# EAGLE board ARM_board (EAGLE 6.1), part 1 of 2
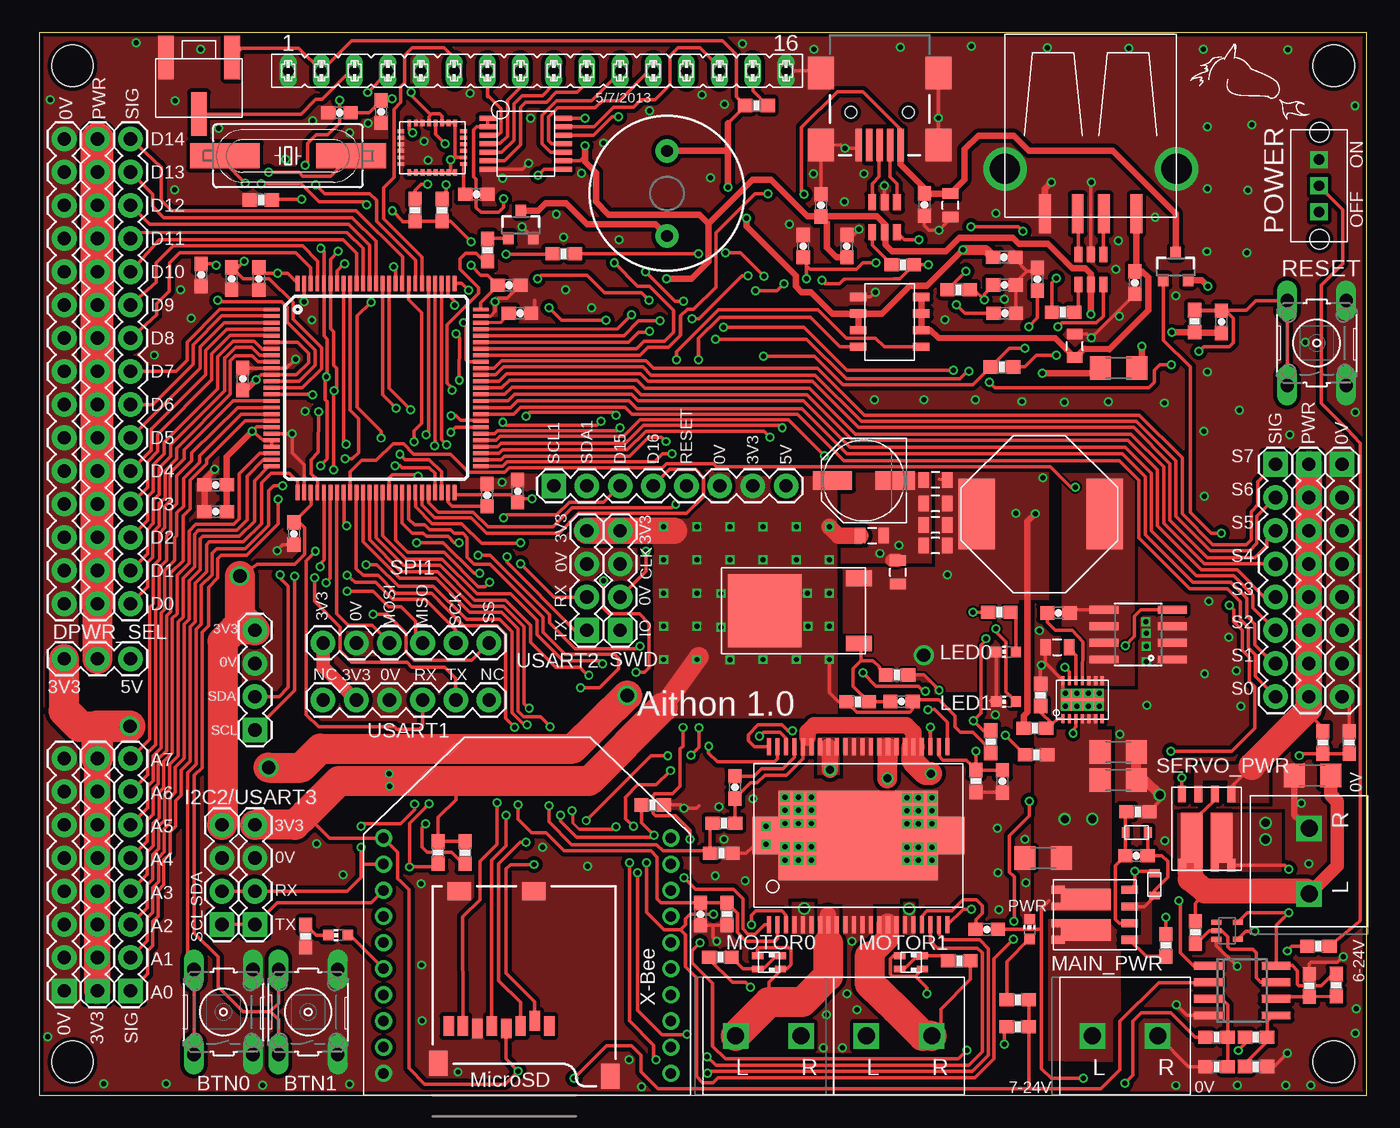
[diagram p2: board, top side]
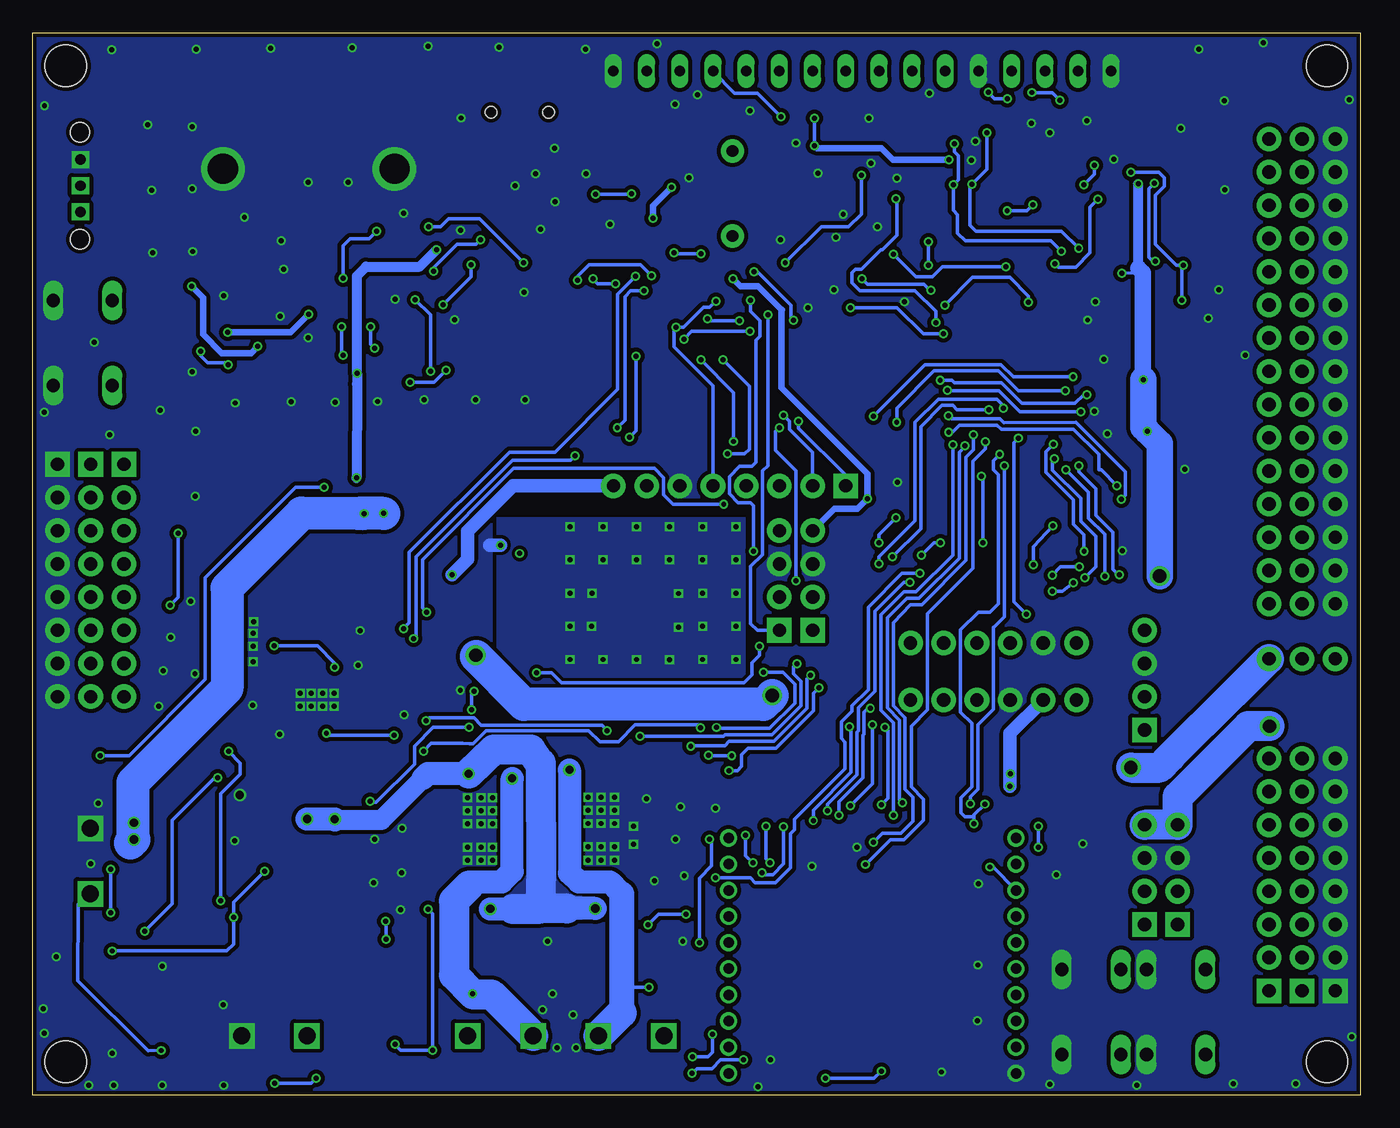
[diagram p3: board, bottom side, seen from below]

Size 101.6 x 81.28 mm. Coordinates in mm from the lower left corner, seen from the top.
Outline: 0,0 101.6,0 101.6,81.28 0,81.28 0,0
Copper layers (1*16): Top 0.035mm / dielectric 1.5mm / Bottom 0.035mm
Design rules: minimum track width 6mil, minimum drill 12mil, track to track 6mil, track to pad 6mil, pad to pad 6mil, via to via 6mil, smd to smd 0mil, copper to edge 10mil, drill to drill 10mil, minimum pad ring 10mil, minimum via ring 6mil, stop-mask expansion 2mil, vias tented up to drill 100mil, thermal gap 10mil
Holes 3.17 mm at 2.54,78.74 99.06,78.74 99.06,2.54 2.54,2.54

## Footprints (pad centres in the part's own frame; a part is rotated, then mirrored left to right if it is on the bottom)
DPAK = smd 1.2 x 2: 1 -2.5,-2.5; 3 2.5,-2.5 | smd 5.6 x 5.6: TAB 0,4.7
B3F-10XX = drill 1.016 long: 1 -3.251,2.261; 2 3.251,2.261; 3 -3.251,-2.261; 4 3.251,-2.261
0805 = smd 0.8 x 1.2: 1 -0.9,0; 2 0.9,0
0603-CAP = smd 1.1 x 1: 1 -0.85,0; 2 0.85,0
1206 = smd 1.6 x 1.8: 1 -1.4,0; 2 1.4,0
PANASONIC_D = smd 3 x 1.4: + 2.4,0; - -2.4,0
1206' = smd 1.6 x 1.8: 1 -0.13,2.54; 2 2.67,2.54
TQFP100 = smd 1.2 x 0.3: 1 -8,6; 2 -8,5.5; 3 -8,5; 4 -8,4.5; 5 -8,4; 6 -8,3.5; 7 -8,3; 8 -8,2.5; 9 -8,2; 10 -8,1.5; 11 -8,1; 12 -8,0.5; 13 -8,0; 14 -8,-0.5; 15 -8,-1; 16 -8,-1.5; 17 -8,-2; 18 -8,-2.5; 19 -8,-3; 20 -8,-3.5; 21 -8,-4; 22 -8,-4.5; 23 -8,-5; 24 -8,-5.5; 25 -8,-6; 51 8,-6; 52 8,-5.5; 53 8,-5; 54 8,-4.5; 55 8,-4; 56 8,-3.5; 57 8,-3; 58 8,-2.5; 59 8,-2; 60 8,-1.5; 61 8,-1; 62 8,-0.5; 63 8,0; 64 8,0.5; 65 8,1; 66 8,1.5; 67 8,2; 68 8,2.5; 69 8,3; 70 8,3.5; 71 8,4; 72 8,4.5; 73 8,5; 74 8,5.5; 75 8,6 | smd 0.3 x 1.2: 26 -6,-8; 27 -5.5,-8; 28 -5,-8; 29 -4.5,-8; 30 -4,-8; 31 -3.5,-8; 32 -3,-8; 33 -2.5,-8; 34 -2,-8; 35 -1.5,-8; 36 -1,-8; 37 -0.5,-8; 38 0,-8; 39 0.5,-8; 40 1,-8; 41 1.5,-8; 42 2,-8; 43 2.5,-8; 44 3,-8; 45 3.5,-8; 46 4,-8; 47 4.5,-8; 48 5,-8; 49 5.5,-8; 50 6,-8; 76 6,8; 77 5.5,8; 78 5,8; 79 4.5,8; 80 4,8; 81 3.5,8; 82 3,8; 83 2.5,8; 84 2,8; 85 1.5,8; 86 1,8; 87 0.5,8; 88 0,8; 89 -0.5,8; 90 -1,8; 91 -1.5,8; 92 -2,8; 93 -2.5,8; 94 -3,8; 95 -3.5,8; 96 -4,8; 97 -4.5,8; 98 -5,8; 99 -5.5,8; 100 -6,8
SO08 = smd 0.6 x 2.2: 1 -1.905,-2.6; 2 -0.635,-2.6; 3 0.635,-2.6; 4 1.905,-2.6; 5 1.905,2.6; 6 0.635,2.6; 7 -0.635,2.6; 8 -1.905,2.6
1X04 = drill 1.016 pad 1.88 square: 1 0,0 | drill 1.016 pad 1.88: 2 2.54,0; 3 5.08,0; 4 7.62,0
1X06 = drill 1.016 pad 1.88: 1 0,0; 2 2.54,0; 3 5.08,0; 4 7.62,0; 5 10.16,0; 6 12.7,0
1X08 = drill 1.016 pad 1.88 square: 1 0,0 | drill 1.016 pad 1.88: 2 2.54,0; 3 5.08,0; 4 7.62,0; 5 10.16,0; 6 12.7,0; 7 15.24,0; 8 17.78,0
1X15 = drill 1.016 pad 1.88: 1 0,0; 2 2.54,0; 3 5.08,0; 4 7.62,0; 5 10.16,0; 6 12.7,0; 7 15.24,0; 8 17.78,0; 9 20.32,0; 10 22.86,0; 11 25.4,0; 12 27.94,0; 13 30.48,0; 14 33.02,0; 15 35.56,0
1X03 = drill 1.016 pad 1.88: 1 0,0; 2 2.54,0; 3 5.08,0
INDUCTOR = smd 2.8 x 5.4: P$1 0,0; P$2 9.8,0
LCD = drill 0.8 long: A 16.51,0; DB0 -3.81,0; DB1 -1.27,0; DB2 1.27,0; DB3 3.81,0; DB4 6.35,0; DB5 8.89,0; DB6 11.43,0; DB7 13.97,0; E -6.35,0; K 19.05,0; R/W -8.89,0; RS -11.43,0; VDD -16.51,0; VO -13.97,0; VSS -19.05,0
CHIP-LED0603 = smd 0.8 x 0.8: A 0,-0.75; C 0,0.75
LED-0606 = smd 0.85 x 0.5: 1 0.875,0.5; 2 -0.875,0.5; 3 0.875,-0.5; 4 -0.875,-0.5
2POS_TERMINAL = drill 1.3 square: L -5,0; R 0,0
POT = smd 1.194 x 3.302: 1 -2.54,0; 2 0,4.318; 3 2.54,0
SOT23-3 = smd 0.8 x 0.9: 1 -0.95,-1; 2 0.95,-1; 3 0,1.1
SO08' = smd 0.61 x 2.21: 1 -1.905,-2.616; 2 -0.635,-2.616; 3 0.635,-2.616; 4 1.905,-2.616; 5 1.905,2.616; 6 0.635,2.616; 7 -0.635,2.616; 8 -1.905,2.616
POWERPAK = smd 1.27 x 0.61: 1 0,2.54; 2 0,1.27; 3 0,0; 4 0,-1.27 | smd 1.016 x 0.61: 5 5.461,-1.27; 6 5.461,0; 7 5.461,1.27; 8 5.461,2.54 | smd 3.81 x 1.651: 9 3.353,1.791; 10 3.353,-0.521
0603-RES = smd 1.1 x 1: 1 -0.85,0; 2 0.85,0
MICRO-SD-SOCKET-PP = smd 0.8 x 1.5: 1 -8.94,10.7; 2 -7.84,10.3; 3 -6.74,10.7; 4 -5.64,10.9; 5 -4.54,10.7; 6 -3.44,10.9; 7 -2.34,10.7; 8 -1.24,10.7 | smd 1.8 x 1.4: CD1 -2.05,0.4; CD2 -7.75,0.4 | smd 1.4 x 1.9: GND1 -13.6,14.55; GND3 -0.45,13.55
BUZZER-12MM = drill 0.9 pad 1.778: + 3.25,0; - -3.25,0
SW = drill 0.8 square: P$1 0,0; P$2 2,0; P$3 -2,0 | hole 1.5: -4.1,-0.04; 4.1,-0.04
HSOP44 = smd 1.3 x 0.3: P$1 -6.85,6.85; P$2 -6.85,6.2; P$3 -6.85,5.55; P$4 -6.85,4.9; P$5 -6.85,4.25; P$6 -6.85,3.6; P$7 -6.85,2.95; P$8 -6.85,2.3; P$9 -6.85,1.65; P$10 -6.85,1; P$11 -6.85,0.35; P$12 -6.85,-0.3; P$13 -6.85,-0.95; P$14 -6.85,-1.6; P$15 -6.85,-2.25; P$16 -6.85,-2.9; P$17 -6.85,-3.55; P$18 -6.85,-4.2; P$19 -6.85,-4.85; P$20 -6.85,-5.5; P$21 -6.85,-6.15; P$22 -6.85,-6.8; P$23 6.8,-6.8; P$24 6.8,-6.15; P$25 6.8,-5.5; P$26 6.8,-4.85; P$27 6.8,-4.2; P$28 6.8,-3.55; P$29 6.8,-2.9; P$30 6.8,-2.25; P$31 6.8,-1.6; P$32 6.8,-0.95; P$33 6.8,-0.3; P$34 6.8,0.35; P$35 6.8,1; P$36 6.8,1.65; P$37 6.8,2.3; P$38 6.8,2.95; P$39 6.8,3.6; P$40 6.8,4.25; P$41 6.8,4.9; P$42 6.8,5.55; P$43 6.8,6.2; P$44 6.8,6.85 | smd 6.85 x 12.2: P$45 0,0 | smd 2.9 x 2: P$46 0,7.1; P$47 0,-7.1
WDFN-14L = smd 0.25 x 0.7: 1 -1.5,-1.45; 2 -1,-1.45; 3 -0.5,-1.45; 4 0,-1.45; 5 0.5,-1.45; 6 1,-1.45; 7 1.5,-1.45; 8 1.5,1.45; 9 1,1.45; 10 0.5,1.45; 11 0,1.45; 12 -0.5,1.45; 13 -1,1.45; 14 -1.5,1.45 | smd 3.3 x 1.7: P$1 0,0
SC70 = smd 0.4 x 0.75: 1 -0.65,-0.825; 2 0,-0.825; 3 0.65,-0.825; 4 0.65,0.825; 5 -0.65,0.825
SOT23-6L = smd 1.2 x 0.6: P$1 -1.1,0.9; P$2 -1.1,-0.05; P$3 -1.1,-1; P$4 1.2,-1; P$5 1.2,-0.05; P$6 1.2,0.9
LGA-28 = smd 0.5 x 0.3: 1 -2.4,1.25; 2 -2.4,0.75; 3 -2.4,0.25; 4 -2.4,-0.25; 5 -2.4,-0.75; 6 -2.4,-1.25; 15 2.4,-1.25; 16 2.4,-0.75; 17 2.4,-0.25; 18 2.4,0.25; 19 2.4,0.75; 20 2.4,1.25 | smd 0.3 x 0.5: 7 -1.75,-1.9; 8 -1.25,-1.9; 9 -0.75,-1.9; 10 -0.25,-1.9; 11 0.25,-1.9; 12 0.75,-1.9; 13 1.25,-1.9; 14 1.75,-1.9; 21 1.75,1.9; 22 1.25,1.9; 23 0.75,1.9; 24 0.25,1.9; 25 -0.25,1.9; 26 -0.75,1.9; 27 -1.25,1.9; 28 -1.75,1.9
8-SOIC = smd 0.635 x 1.27: 1 -1.27,-1.778; 2 0,-1.778; 3 1.27,-1.778; 4 2.54,-1.778; 5 2.54,3.048; 6 1.27,3.048; 7 0,3.048; 8 -1.27,3.048
TSSOP-14 = smd 1.26 x 0.36: 1 -2.9,1.95; 2 -2.9,1.3; 3 -2.9,0.65; 4 -2.9,0; 5 -2.9,-0.65; 6 -2.9,-1.3; 7 -2.9,-1.95; 8 2.9,-1.95; 9 2.9,-1.3; 10 2.9,-0.65; 11 2.9,0; 12 2.9,0.65; 13 2.9,1.3; 14 2.9,1.95
USB-A-S = smd 3 x 0.9: D+ 3.45,-1; D- 3.45,1; GND 3.45,-3.5; VBUS 3.45,3.5 | drill 2.311: GND@1 0,6.566; GND@2 0,-6.566
USB-MINIB = smd 2.5 x 0.5: D+ 2.5,0; D- 2.5,0.8; GND 2.5,-1.6; ID 2.5,-0.8; VBUS 2.5,1.6 | smd 2.5 x 2: MTN1 -3,4.5; MTN2 2.5,4.5; MTN3 -3,-4.5; MTN4 2.5,-4.5 | hole 0.9: 0,2.2; 0,-2.2
XBEE = drill 0.8 pad 1.27: 1 -11,9; 2 -11,7; 3 -11,5; 4 -11,3; 5 -11,1; 6 -11,-1; 7 -11,-3; 8 -11,-5; 9 -11,-7; 10 -11,-9; 11 11,-9; 12 11,-7; 13 11,-5; 14 11,-3; 15 11,-1; 16 11,1; 17 11,3; 18 11,5; 19 11,7; 20 11,9
HC49UP = smd 5.334 x 1.93: 1 -4.826,0; 2 4.826,0
0603 = smd 0.6 x 0.8: P$1 1.7,0; P$2 0,0

## Placement (x,y rotation side)
AP1084  AP1084  [DPAK]  60.22,37.05 90 top
BTN0  [B3F-10XX]  14.1,6.35 90 top
BTN1  [B3F-10XX]  20.57,6.35 90 top
C1  10u  [0805]  65.71,40.01 90 top
C2  20p  [0603-CAP]  14.72,62.47 270 top
C3  22u  [0805]  68.58,47.07 180 top
C4  22u  [0805]  68.58,45.26 180 top
C5  22u  [0805]  68.58,43.61 180 top
C6  10u  [0805]  63.74,42.8 0 top
C7  2.2u  [0603-CAP]  34.26,45.9 90 top
C8  0.1u  [0603-CAP]  72.52,12.67 180 top
C9  0.1u  [0603-CAP]  53.24,23.55 270 top
C10  1u  [0603-CAP]  50.6,13.85 270 top
C11  1u  [0603-CAP]  73.71,24 270 top
C12  0.1u  [0603-CAP]  59.82,68.07 90 top
C13  47p  [0603-CAP]  73.89,59.82 0 top
C14  47p  [0603-CAP]  73.86,61.98 0 top
C15  0.1u  [0603-CAP]  73.84,64.11 0 top
C16  0.1u  [0603-CAP]  61.8,64.95 90 top
C17  47p  [0603-CAP]  58.46,64.95 90 top
C18  47p  [0603-CAP]  76.39,62.41 90 top
C19  20p  [0603-CAP]  12.38,62.75 270 top
C21  0.1u  [0603-CAP]  83.86,62.16 270 top
C22  0.1u  [0603-CAP]  67.74,68.12 90 top
C23  10u  [0805]  79.24,57.32 90 top
C24  10u  [0805]  69.72,68.07 90 top
C25  10u  [0603-CAP]  26.16,75.24 270 top
C26  10u  [1206]  82.58,26.24 0 top
C27  22u  [1206]  97.43,24.43 180 top
C28  10u  [1206]  82.58,24.1 0 top
C29  0.1u  [0603-CAP]  83.97,18.31 180 top
C30  10n  [0603-CAP]  90.47,59.16 90 top
C31  22u  [1206]  76.83,18.14 180 top
C32  1u  [0603-CAP]  78,36.88 0 top
C33  10u  [0805]  77.9,34.26 0 top
C34  0.1u  [0603-CAP]  22.97,75.16 180 top
C35  10n  [0603-CAP]  33.45,68.92 0 top
C36  22u  [0805]  68.58,42.04 180 top
C37  2.2u  [0603-CAP]  36.78,59.82 0 top
C38  0.1u  [0603-CAP]  65.99,30.11 180 top
C39  4.7u  [0603-CAP]  15.58,54.79 90 top
C40  100n  [0603-CAP]  16.8,62.47 270 top
C41  100n  [0603-CAP]  35.96,61.96 0 top
C42  100n  [0603-CAP]  19.49,42.96 270 top
C43  100n  [0603-CAP]  36.62,46.21 90 top
C44  220u  [PANASONIC_D]  63.1,47.02 180 top
C46  1u  [0603-CAP]  13.5,44.64 180 top
C47  10n  [0603-CAP]  13.5,46.68 180 top
F1  POLYFUSE  [1206']  83.88,58.16 180 top
IC3  STM32F407VET  [TQFP100]  25.78,54.1 0 top
IC4  LM358D  [SO08]  92.06,8 270 top
J1  USART/I2C  [1X04]  13.97,13.06 90 top
J2  I2C2/USART3  [1X04]  16.51,13.06 90 top
J3  USART2  [1X04]  41.91,35.56 90 top
J4  I2C1  [1X04]  16.51,27.94 90 top
J5  SPI  [1X06]  21.72,34.59 0 top
J6  Bluesmirf  [1X06]  34.42,30.23 180 top
J7  SWD  [1X04]  44.45,35.56 90 top
J8  AGND  [1X08]  1.91,7.98 90 top
J9  APWR  [1X08]  4.45,7.98 90 top
J10  ANALOG  [1X08]  6.99,7.98 90 top
J11  DGND  [1X15]  1.91,37.59 90 top
J12  DPWR  [1X15]  4.45,37.59 90 top
J13  DIGITAL  [1X15]  6.99,37.59 90 top
J14  SGND  [1X08]  99.69,48.26 270 top
J15  SPWR  [1X08]  97.16,48.26 270 top
J16  SERVO  [1X08]  94.61,48.26 270 top
JP1  SHIELD  [1X08]  39.37,46.61 0 top
JP2  DPWR_SEL  [1X03]  1.91,33.38 0 top
L1  2.7u  [INDUCTOR]  81.53,44.45 180 top
LCD  LCD_DISPLAY  [LCD]  38.1,78.36 0 top
LED2  YELLOW  [CHIP-LED0603]  73.99,33.91 90 top
LED3  YELLOW  [CHIP-LED0603]  73.99,30.1 90 top
LED4  RED  [CHIP-LED0603]  75.78,12.7 0 top
LED5  YELLOW  [CHIP-LED0603]  22.87,12.24 90 top
LED6  LED_R/G  [LED-0606]  55.85,10.16 180 top
LED7  LED_R/G  [LED-0606]  66.73,10.16 180 top
MOTOR0  2POS_TERMINAL  [2POS_TERMINAL]  58.29,4.52 0 top
MOTOR1  2POS_TERMINAL  [2POS_TERMINAL]  68.3,4.52 0 top
POT  10K  [POT]  12.22,79.38 180 top
POWER  2POS_TERMINAL  [2POS_TERMINAL]  85.6,4.52 0 top
Q1  Si2301  [SOT23-3]  86.97,63.35 0 top
Q2  BC817  [SOT23-3]  36.86,66.55 0 top
Q3  FDS6670AS  [SO08']  84.1,35.23 90 top
Q4  SI7997DP  [POWERPAK]  88.7,23.04 270 top
Q5  SI7997DP  [POWERPAK]  83.44,14.43 180 top
R1  10  [0603-RES]  54.88,75.71 180 top
R2  100k  [0603-RES]  84.07,21.69 0 top
R3  100k  [0603-RES]  86.21,11.46 270 top
R4  220  [0603-RES]  74.89,7.29 0 top
R5  10k  [0603-RES]  72.81,27.03 270 top
R6  10k  [0603-RES]  74.88,5.22 180 top
R7  10k  [0603-RES]  88.42,59.21 270 top
R8  220  [0603-RES]  52.63,13.85 90 top
R9  220  [0603-RES]  71.68,24.03 90 top
R10  10k  [0603-RES]  90.1,4.41 180 top
R11  10k  [0603-RES]  90.1,2.18 0 top
R18  93.1k  [0603-RES]  52.4,20.8 180 top
R19  10k  [0603-RES]  52.2,18.52 0 top
R20  220  [0603-RES]  73.47,36.95 180 top
R21  220  [0603-RES]  40.13,64.36 180 top
R22  4.7k  [0603-RES]  28.77,67.71 270 top
R23  4.7k  [0603-RES]  30.82,67.71 270 top
R24  4.7k  [0603-RES]  32.58,18.55 90 top
R25  4.7k  [0603-RES]  30.53,18.56 90 top
R26  10k  [0603-RES]  97.21,8.38 270 top
R27  39k  [0603-RES]  99.26,8.41 90 top
R28  10k  [0603-RES]  93.12,2.18 0 top
R29  39k  [0603-RES]  93.12,4.42 0 top
R31  10k  [0603-RES]  97.89,11.38 0 top
R32  93.1k  [0603-RES]  76.19,28.07 180 top
R33  18k  [0603-RES]  76.63,30.61 270 top
R34  100k  [0603-RES]  76.29,26.04 0 top
R35  220  [0603-RES]  20.4,12.17 90 top
R36  10k  [0603-RES]  88.47,12.45 90 top
R37  2k  [0603-RES]  52.12,10.54 0 top
R38  2k  [0603-RES]  70.41,10.26 180 top
R39  10k  [0603-RES]  34.32,64.64 90 top
R40  93.1k  [0603-RES]  98.22,26.97 270 top
R41  10k  [0603-RES]  100.24,26.97 90 top
R42  10k  [0603-RES]  16.96,68.48 0 top
R43  10k  [0603-RES]  46.94,22.19 180 top
R44  2k  [0603-RES]  65.64,32.14 180 top
R45  1.21k  [0603-RES]  62.64,30.09 180 top
R46  15  [0603-RES]  70.35,61.62 0 top
R47  15  [0603-RES]  66.09,63.51 0 top
R48  15  [0603-RES]  78.35,59.88 180 top
R49  15  [0603-RES]  73.67,55.7 180 top
RESET  [B3F-10XX]  97.76,57.53 90 top
SD  USD-SOCKETNEW  [MICRO-SD-SOCKET-PP]  30.09,15.99 180 top
SERVO_PWR  2POS_TERMINAL  [2POS_TERMINAL]  97.18,20.4 90 top
SG1  BUZZERPTH  [BUZZER-12MM]  48.05,68.98 90 top
SW1  SW  [SW]  97.94,69.57 90 top
U1  MC33932  [HSOP44]  62.69,19.86 90 top
U2  RT7259  [WDFN-14L]  79.83,30.25 0 top
U3  NC7SZU04  [SC70]  90.91,12.57 270 top
U6  USBLC6-2  [SOT23-6L]  80.53,63.22 270 top
U8  USBLC6-2  [SOT23-6L]  64.74,67.21 270 top
U$1  LSM330DLC  [LGA-28]  30.07,72.48 0 top
U$2  RT9715  [8-SOIC]  64.45,59.79 270 top
U$3  MC74HC164  [TSSOP-14]  37.22,72.78 0 top
USB1  USB-A-S  [USB-A-S]  80.47,70.87 270 top
USB2  USB-MINIB-5PIN  [USB-MINIB]  64.31,75.18 270 top
XB1  XBEE  [XBEE]  37.34,10.67 0 top
Y2  8MHz  [HC49UP]  19.04,71.86 0 top
ZD1  15V  [0603]  84.84,20.09 180 top
ZD2  15V  [0603]  85.34,15.27 90 top